# EAGLE design LM317_3S_LithiumCharger_2018_05_13 (EAGLE 7.4.0)
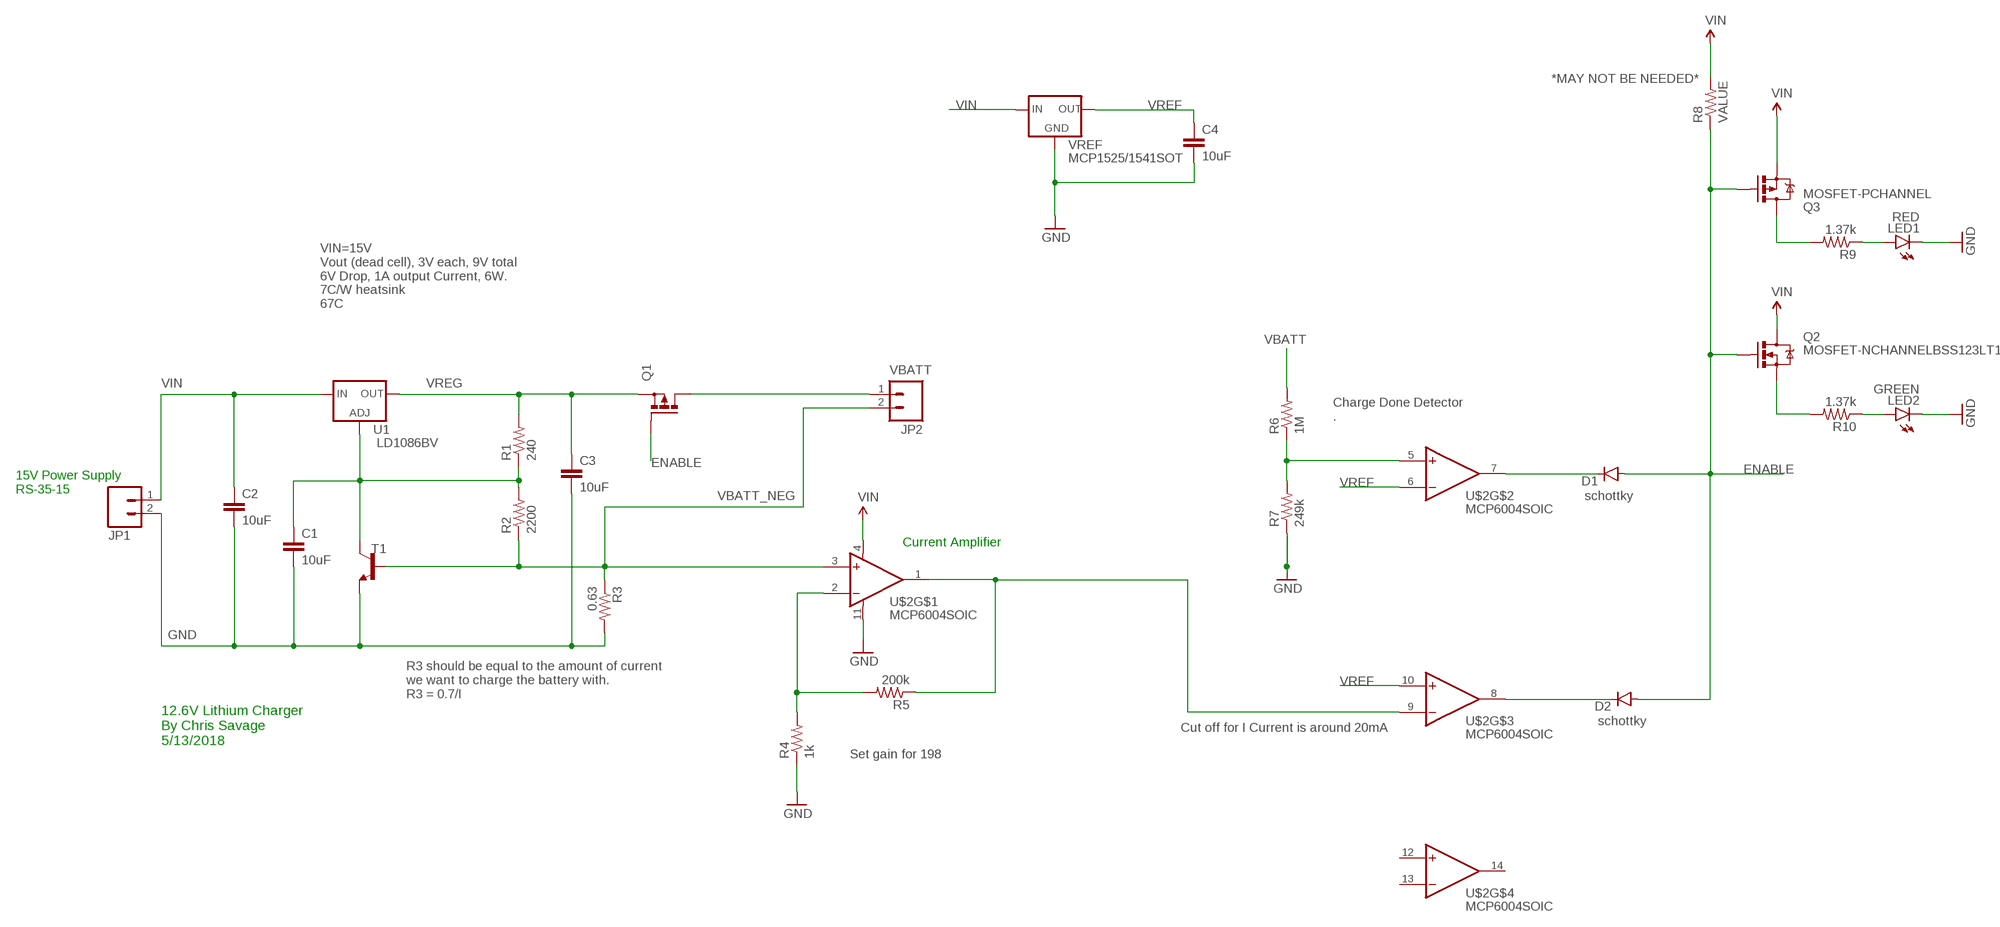
[diagram p0: schematic, sheet 1]

## Parts
C1  10uF  CAP1206  [1206]
C2  10uF  CAP1206  [1206]
C3  10uF  CAP1206  [1206]
C4  10uF  CAP1206  [1206]
D1  DIODESOD123  [SOD-123]
D2  DIODESOD123  [SOD-123]
JP1  M02POLAR_LOCK  [MOLEX-1X2_LOCK]
JP2  M02POLAR_LOCK  [MOLEX-1X2_LOCK]
LED1  RED  LED5MM  [LED5MM]
LED2  GREEN  LED5MM  [LED5MM]
Q1  PMOSFET_PTO220BV  [TO220BV]
Q2  MOSFET-NCHANNELBSS123LT1G  [SOT23-3]
Q3  MOSFET-PCHANNEL  [SOT23-3]
R1  240  RESISTOR1206  [1206]
R2  2200  RESISTOR1206  [1206]
R3  0.63  RESISTOR2512  [R2512]
R4  1k  RESISTOR1206  [1206]
R5  200k  RESISTOR1206  [1206]
R6  1M  RESISTOR1206  [1206]
R7  249k  RESISTOR1206  [1206]
R8  VALUE  RESISTOR1206  [1206]
R9  1.37k  RESISTOR1206  [1206]
R10  1.37k  RESISTOR1206  [1206]
T1  MMBT3904LT1-NPN-SOT23-BEC  [SOT23-BEC]
U1  LD1086BV  LM317TS  [317TS]
U$2  MCP6004SOIC  [SOIC-14]
VREF  MCP1525/1541SOT  [SOT23-3]

## Nets
ENABLE: D1.A D2.A Q1.G Q2.1(G) Q3.1(G) R8.1
GND: C1.2 C2.2 C3.2 C4.2 JP1.2 LED1.K(C) LED2.K(C) R3.2 R4.1 R7.1 T1.E U$2.11(V-) VREF.3(GND)
IOUT: R5.1 U$2.1(OUT) U$2.9(-IN)
N$1: R4.2 R5.2 U$2.2(-IN)
N$2: C1.1 R1.1 R2.2 T1.C U1.1(ADJ)
N$3: D1.C U$2.7(OUT)
N$4: R6.1 R7.2 U$2.5(+IN)
N$5: LED1.A R9.1
N$6: D2.C U$2.8(OUT)
N$7: Q2.2(S) R10.2
N$8: Q3.3(D) R9.2
N$9: LED2.A R10.1
VBATT: JP2.1 Q1.D R6.2
VBATT_NEG: JP2.2 R2.1 R3.1 T1.B U$2.3(+IN)
VIN: C2.1 JP1.1 Q2.3(D) Q3.2(S) R8.2 U1.3(IN) U$2.4(V+) VREF.1(IN)
VREF: C4.1 U$2.6(-IN) U$2.10(+IN) VREF.2(OUT)
VREG: C3.1 Q1.S R1.2 U1.2(OUT)
Unconnected: U$2.12(+IN) U$2.13(-IN) U$2.14(OUT)

## Notes on the sheet
- *MAY NOT BE NEEDED*
- VIN=15V
  Vout (dead cell), 3V each, 9V total
  6V Drop, 1A output Current, 6W.
  7C/W heatsink
  67C
- Charge Done Detector 
  .
- 15V Power Supply
  RS-35-15
- schottky
- Current Amplifier
- R3 should be equal to the amount of current
  we want to charge the battery with. 
  R3 = 0.7/I
- schottky
- Cut off for I Current is around 20mA
- 12.6V Lithium Charger
  By Chris Savage
  5/13/2018
- Set gain for 198

## Library data of the parts
C1-C4 = SparkFun-Capacitors:CAP: Capacitor Standard 0603 ceramic capacitor, and 0.1" leaded capacitor.
D1 D2 = SparkFun-DiscreteSemi:DIODE: Diode These are standard reverse protection diodes and small signal diodes. SMA package can handle up to about 1A. SOD-323 can handle about 200mA. What the SOD-323 package when ordering, there are some mfgs out there that are 5-pin packages.
JP1 JP2 = SparkFun-Connectors:M02: Standard 2-pin 0.1" header. Use with - straight break away headers ( PRT-00116) - right angle break away headers (PRT-00553) - swiss pins (PRT-00743) - machine pins (PRT-00117) - female headers (PRT-00115) Molex polarized connector foot print use with: PRT-08233 with associated crimp pins and housings. 2.54_SCREWTERM for use with PRT-10571. 3.5mm Screw Terminal footprints for PRT-08084 5mm Screw Terminal footprints for use with PRT-08432
LED1 LED2 = SparkFun-LED:LED: LEDs Standard schematic elements and footprints for 5mm, 3mm, 1206, and 0603 sized LEDs. 5mm - Spark Fun Electronics SKU : COM-00529 (and others)
Q1 = transistor-power:PMOSFET_P: Power MOSFET P-Channel
Q2 = SparkFun-DiscreteSemi:MOSFET-NCHANNEL: Common NMOSFET Parts MFG P/N Store ID Prod ID FDD8780 TRANS-09984 SI7820DN TRANS-11055 FDS6630A IC-08089 2N7002PW TRANS-11151 FQP30N06L COM-10213 TRANS-10060 BSS123LT1G TRANS-08345 BSS138 TRANS-00830 BS170 2N7000; PROD_ID: TRANS-08345
Q3 = SparkFun-DiscreteSemi:MOSFET-PCHANNEL: Generic PMOSFET IRLML2244 - TRANS-11153 (SOT-23 -20V -4.3A) (1.Gate 2.Source 3.Drain) FQP27P06 - COM-10349 <http://www.sparkfun.com/products/10349> (TO-220 -60V -27A) (1.Gate 2.Source 3.Drain); PROD_ID: TRANS-08285
R1-R10 = SparkFun-Resistors:RESISTOR: Resistor Basic schematic elements and footprints for 0603, 1206, and PTH resistors.
T1 = transistor-neu-to92:*-NPN-: NPN Transistror
U1 = v-reg:LM317TS: VOLTAGE REGULATOR
U$2 = MCP600X:MCP6004
VREF = MCP1525:MCP1525/1541

## Board
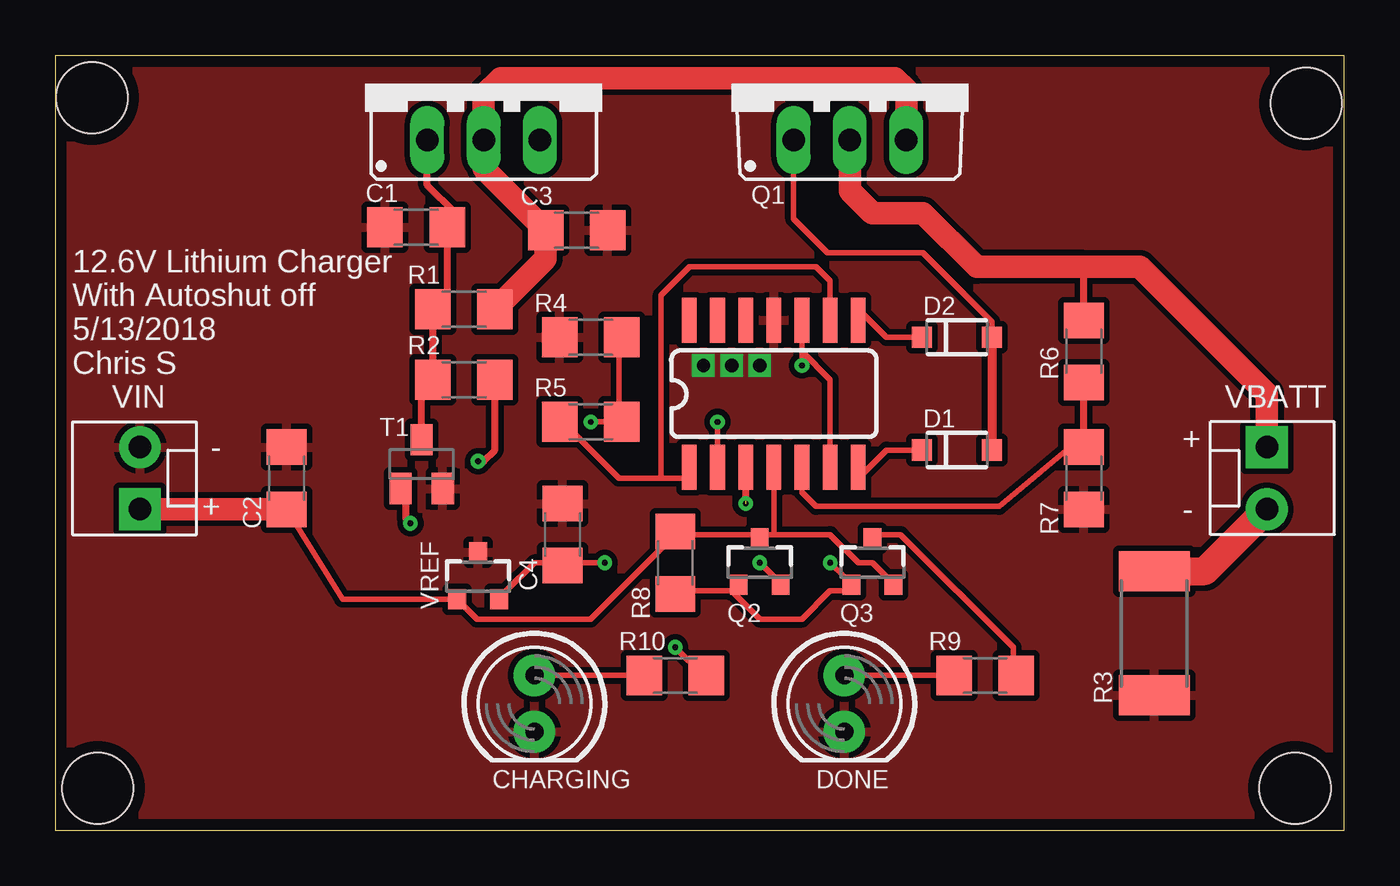
[diagram p1: board, top side]
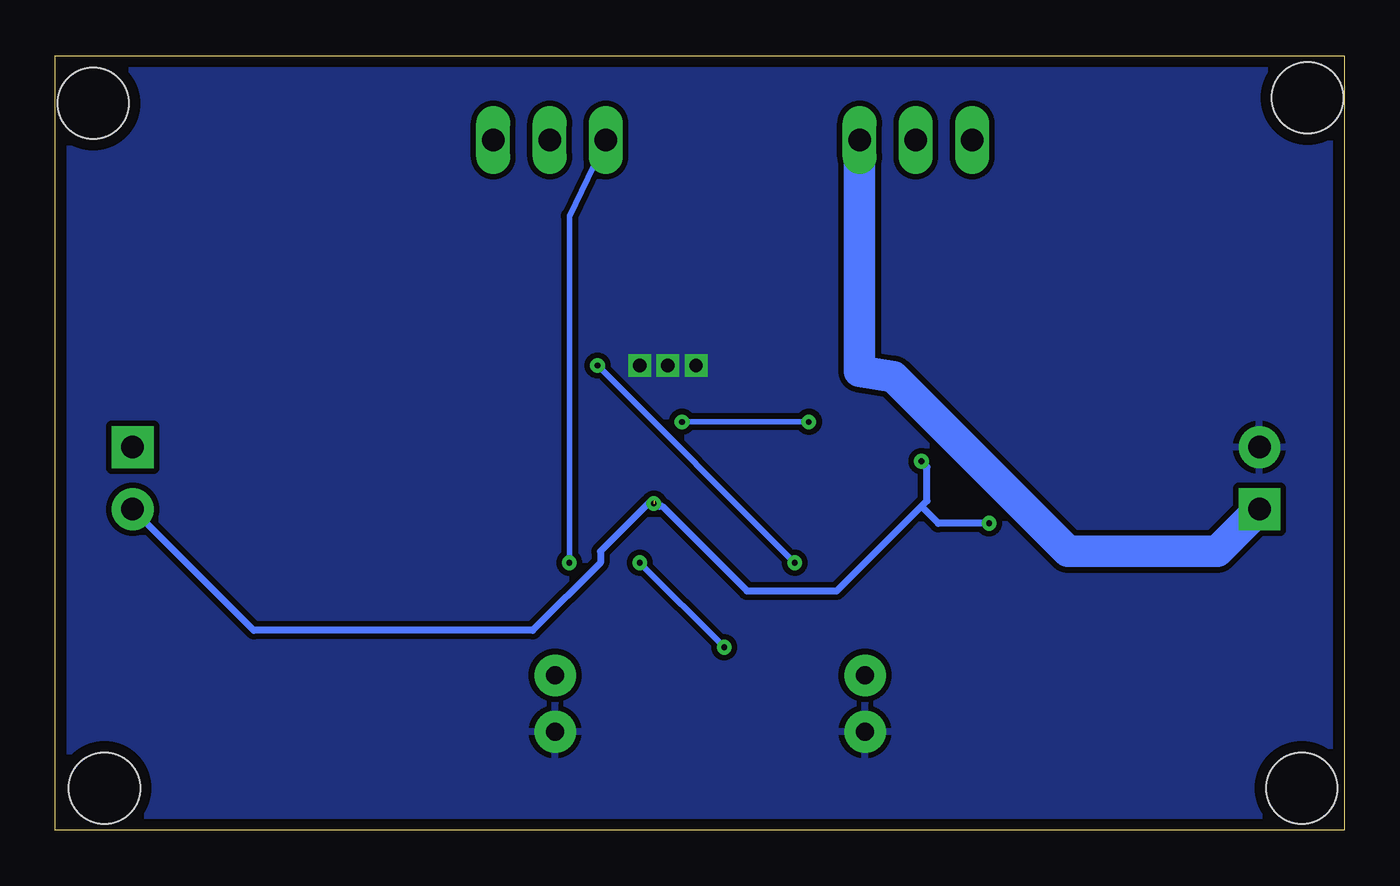
[diagram p2: board, bottom side, seen from below]

Size 58.09 x 34.91 mm. Coordinates in mm from the lower left corner, seen from the top.
Outline: 0,0 58.09,0 58.09,34.91 0,34.91 0,0
Copper layers (1*16): Top 0.035mm / dielectric 1.5mm / Bottom 0.035mm
Design rules "default": minimum track width 10mil, minimum drill 10mil, track to track 10mil, track to pad 10mil, pad to pad 10mil, via to via 10mil, smd to smd 8mil, copper to edge 20mil, drill to drill 10mil, minimum pad ring 10mil, minimum via ring 8mil, stop-mask expansion 4mil, vias tented up to drill 0mil, thermal gap 10mil
Holes 3.2 mm at 1.65,33.02 56.39,32.77 1.91,1.9 55.88,1.9

### Footprints (pad centres in the part's own frame; a part is rotated, then mirrored left to right if it is on the bottom)
1206 = smd 1.6 x 1.8: 1 -1.4,0; 2 1.4,0
SOD-123 = smd 0.9 x 0.95: A 1.575,0; C -1.575,0
MOLEX-1X2_LOCK = drill 1.016 pad 1.88 square: 1 -0.127,0 | drill 1.016 pad 1.88: 2 2.667,0
LED5MM = drill 0.813 pad 1.88: A -1.27,0; K 1.27,0
TO220BV = drill 1.016 long: D 0,-2.54; G -2.54,-2.54; S 2.54,-2.54
SOT23-3 = smd 0.8 x 0.9: 1 -0.95,-1; 2 0.95,-1; 3 0,1.1
R2512 = smd 1.8 x 3.2: 1 -2.8,0; 2 2.8,0
SOT23-BEC = smd 1 x 1.4: B -0.95,-1.1; C 0,1.1; E 0.95,-1.1
317TS = drill 1.016 long: 1 -2.54,-2.54; 2 0,-2.54; 3 2.54,-2.54
SOIC-14 = smd 0.66 x 2.032: 1 -4.445,-3.315; 2 -3.175,-3.315; 3 -1.905,-3.315; 4 -0.635,-3.315; 5 0.635,-3.315; 6 1.905,-3.315; 7 3.175,-3.315; 8 3.175,3.315; 9 1.905,3.315; 10 0.635,3.315; 11 -0.635,3.315; 12 -1.905,3.315; 13 -3.175,3.315; 14 -4.445,3.315

### Placement (x,y rotation side)
C1  16.26,27.18 180 top
C2  10.41,15.88 90 top
C3  23.49,27.05 0 top
C4  22.86,13.34 90 top
D1  40.64,17.14 0 top
D2  40.64,22.23 0 top
JP1  3.81,14.61 90 top
JP2  54.61,17.14 270 top
LED1  35.56,5.71 270 top
LED2  21.59,5.71 270 top
Q1  35.81,33.66 0 top
Q2  31.75,12.07 0 top
Q3  36.83,12.07 0 top
R1  18.41,23.5 0 top
R2  18.41,20.32 180 top
R3  49.53,8.89 270 top
R4  24.13,22.23 0 top
R5  24.13,18.41 0 top
R6  46.36,21.59 90 top
R7  46.36,15.88 90 top
R8  27.94,12.07 90 top
R9  41.91,6.98 0 top
R10  27.94,6.98 0 top
T1  16.51,16.51 0 top
U1  19.3,33.66 0 top
U$2  33.02,19.68 0 top
VREF  19.05,11.43 0 top

### Tracks (layer width: path | path; a pad name or v marks a point on that pad's centre or on a via)
ENABLE  (via drill 0.25)
  Top 0.254: 30.48,10.79 27.94,10.79 R8.1 | 30.48,10.79 31.75,9.53 33.66,9.53 34.92,10.79 35.56,10.79 Q3.1 35.56,11.43 v34.92,12.07 | 30.48,10.79 Q2.1 | D1.A 42.22,22.94 39.12,26.04 34.8,26.04 33.27,27.56 Q1.G
  Top 0.406: D2.A D1.A
  Bottom 0.254: v34.92,12.07 34.92,27.69 Q1.G
GND  (via drill 0.6)
  other vias: 29.21,20.95 30.48,20.95 31.75,20.95
  pour Top: -2.54,45.09 60.96,45.09 60.96,-6.99 -2.54,-6.99
  pour Bottom: -0.64,45.72 59.05,45.72 59.05,-5.71 -0.64,-5.71
IOUT
  Top 0.254: 27.3,15.88 28.58,15.88 U$2.1 | 27.3,15.88 25.4,15.88 22.86,18.41 R5.1 | U$2.9 34.92,24.77 34.29,25.4 28.58,25.4 27.3,24.13 27.3,15.88
N$1  (via drill 0.25)
  Top 0.254: 25.4,18.41 25.4,22.23 R4.2 | v29.84,18.41 U$2.2 | 25.4,18.41 v24.13,18.41 | 25.4,18.41 R5.2
  Bottom 0.254: v24.13,18.41 v29.84,18.41
N$2
  Top 0.305: T1.C 16.51,19.82 R2.2 R1.1 17.66,24.14 C1.1 18.03,27.56 18.03,27.81 16.76,29.08 U1.1
N$3
  Top 0.254: D1.C 37.47,17.14 36.19,15.88 U$2.7
N$4
  Top 0.254: U$2.5 33.66,15.24 34.29,14.61 42.55,14.61 46.36,17.78
  Top 0.305: R7.2 46.36,17.78 R6.1
N$5
  Top 0.254: LED1.A R9.1
N$6
  Top 0.254: D2.C 37.47,22.23 36.19,23.5 U$2.8
N$7  (via drill 0.25)
  Top 0.254: v31.75,12.07 32.38,11.43 Q2.2 | v27.94,8.25 29.21,6.98 R10.2
  Bottom 0.254: v27.94,8.25 v31.75,12.07
N$8
  Top 0.254: Q3.3 36.83,13.34 38.1,13.34 43.18,8.25 43.18,6.98 R9.2
N$9
  Top 0.254: LED2.A R10.1
VBATT
  Top 0.305: R6.2 46.36,25.4
  Top 1.016: JP2.1 54.61,19.68 48.89,25.4 46.36,25.4 41.53,25.4 39.12,27.81 36.83,27.81 35.81,28.83 Q1.D
VBATT_NEG  (via drill 0.25)  (1 unrouted)
  Top 0.305: T1.B 15.79,15.41 15.79,14.05 v16,13.84 | v19.05,16.64 19.3,16.64 19.81,17.14 R2.1 | U$2.3 v31.11,14.73
  Top 1.27: R3.1 51.82,11.69 JP2.2
  Bottom 0.254: 54.61,13.97 JP2.2
  Bottom 0.305: 19.05,14.61 22.86,10.79 26.92,10.79 30.73,14.61 30.86,14.61 31.11,14.86 | 19.05,14.61 18.8,14.86 18.8,16.38 v19.05,16.64 | v31.11,14.73 31.37,14.73 33.53,12.57 33.53,12.07 36.58,9.02 49.15,9.02 JP2.2 | v16,13.84 18.29,13.84 19.05,14.61
VIN
  Top 0.254: 27.94,13.34 31.75,13.34 | 31.75,13.34 32.38,13.34 | 32.38,13.34 34.92,13.34 36.19,12.07 36.83,12.07 37.47,11.43 Q3.2 | 31.75,13.34 Q2.3 | 32.38,13.34 U$2.4 | R8.2 27.94,13.34 | 27.94,13.34 24.13,9.53 19,9.53 VREF.1 12.93,10.43 C2.1
  Top 1.016: C2.1 JP1.1
  Bottom 1.422: U1.3 21.84,20.7 20.32,20.45 12.45,12.57 5.71,12.57 JP1.1
VREF  (via drill 0.25)
  Top 0.254: 22.86,12.07 21.59,12.07 20.32,10.79 VREF.2 | U$2.6 34.92,20.32 33.66,21.59 | U$2.10 33.66,21.59 | v24.77,12.07 22.86,12.07 | 33.66,21.59 v33.66,20.95 | 22.86,12.07 C4.1
  Bottom 0.254: v33.66,20.95 v24.77,12.07
VREG
  Top 1.016: R1.2 22.09,25.77 C3.1 19.3,29.84 U1.2 19.3,33.15 20.07,33.91 37.85,33.91 38.35,33.4 Q1.S

### Text on the board
tNames: 12.6V Lithium Charger / With Autoshut off / 5/13/2018 / Chris S | VIN | VBATT | + | - | + | - | CHARGING | DONE